# Altium schematic sheet DIOT_PSU_integrated.SchDoc: DI/OT Crate
size 420 x 297 mm; Project: DI/OT Backplane - Front panel PCB; CheckedBy: G. Daniluk; Author: F. Świtakowski; CompanyName: Creotech Instruments SA; DrawnBy: F. Świtakowski; Organization: CERN; Address1: European Organization for Nuclear Research; Address2: CH-1211 Geneve 23 - Switzerland; DocumentNumber: 1; Revision: -; SheetNumber: 1; SheetTotal: 1; EDA_Number: EDA-04213-V3-0; Projet: DI/OT Crate; CreateDate: 1.10.2019; CheckedDate: 10.11.2019; Title2: Front Interface; DivGrp: BE-CEM; Designer: F. Świtakowski; SPICEModelCacheTQWPXFHW: <root> / <DocumentId>TQWPXFHW</DocumentId> / </root>; DocumentName: AFPGA_power.SchDoc; ModifiedDate: -; Rule: PcbType=ProtelPcb
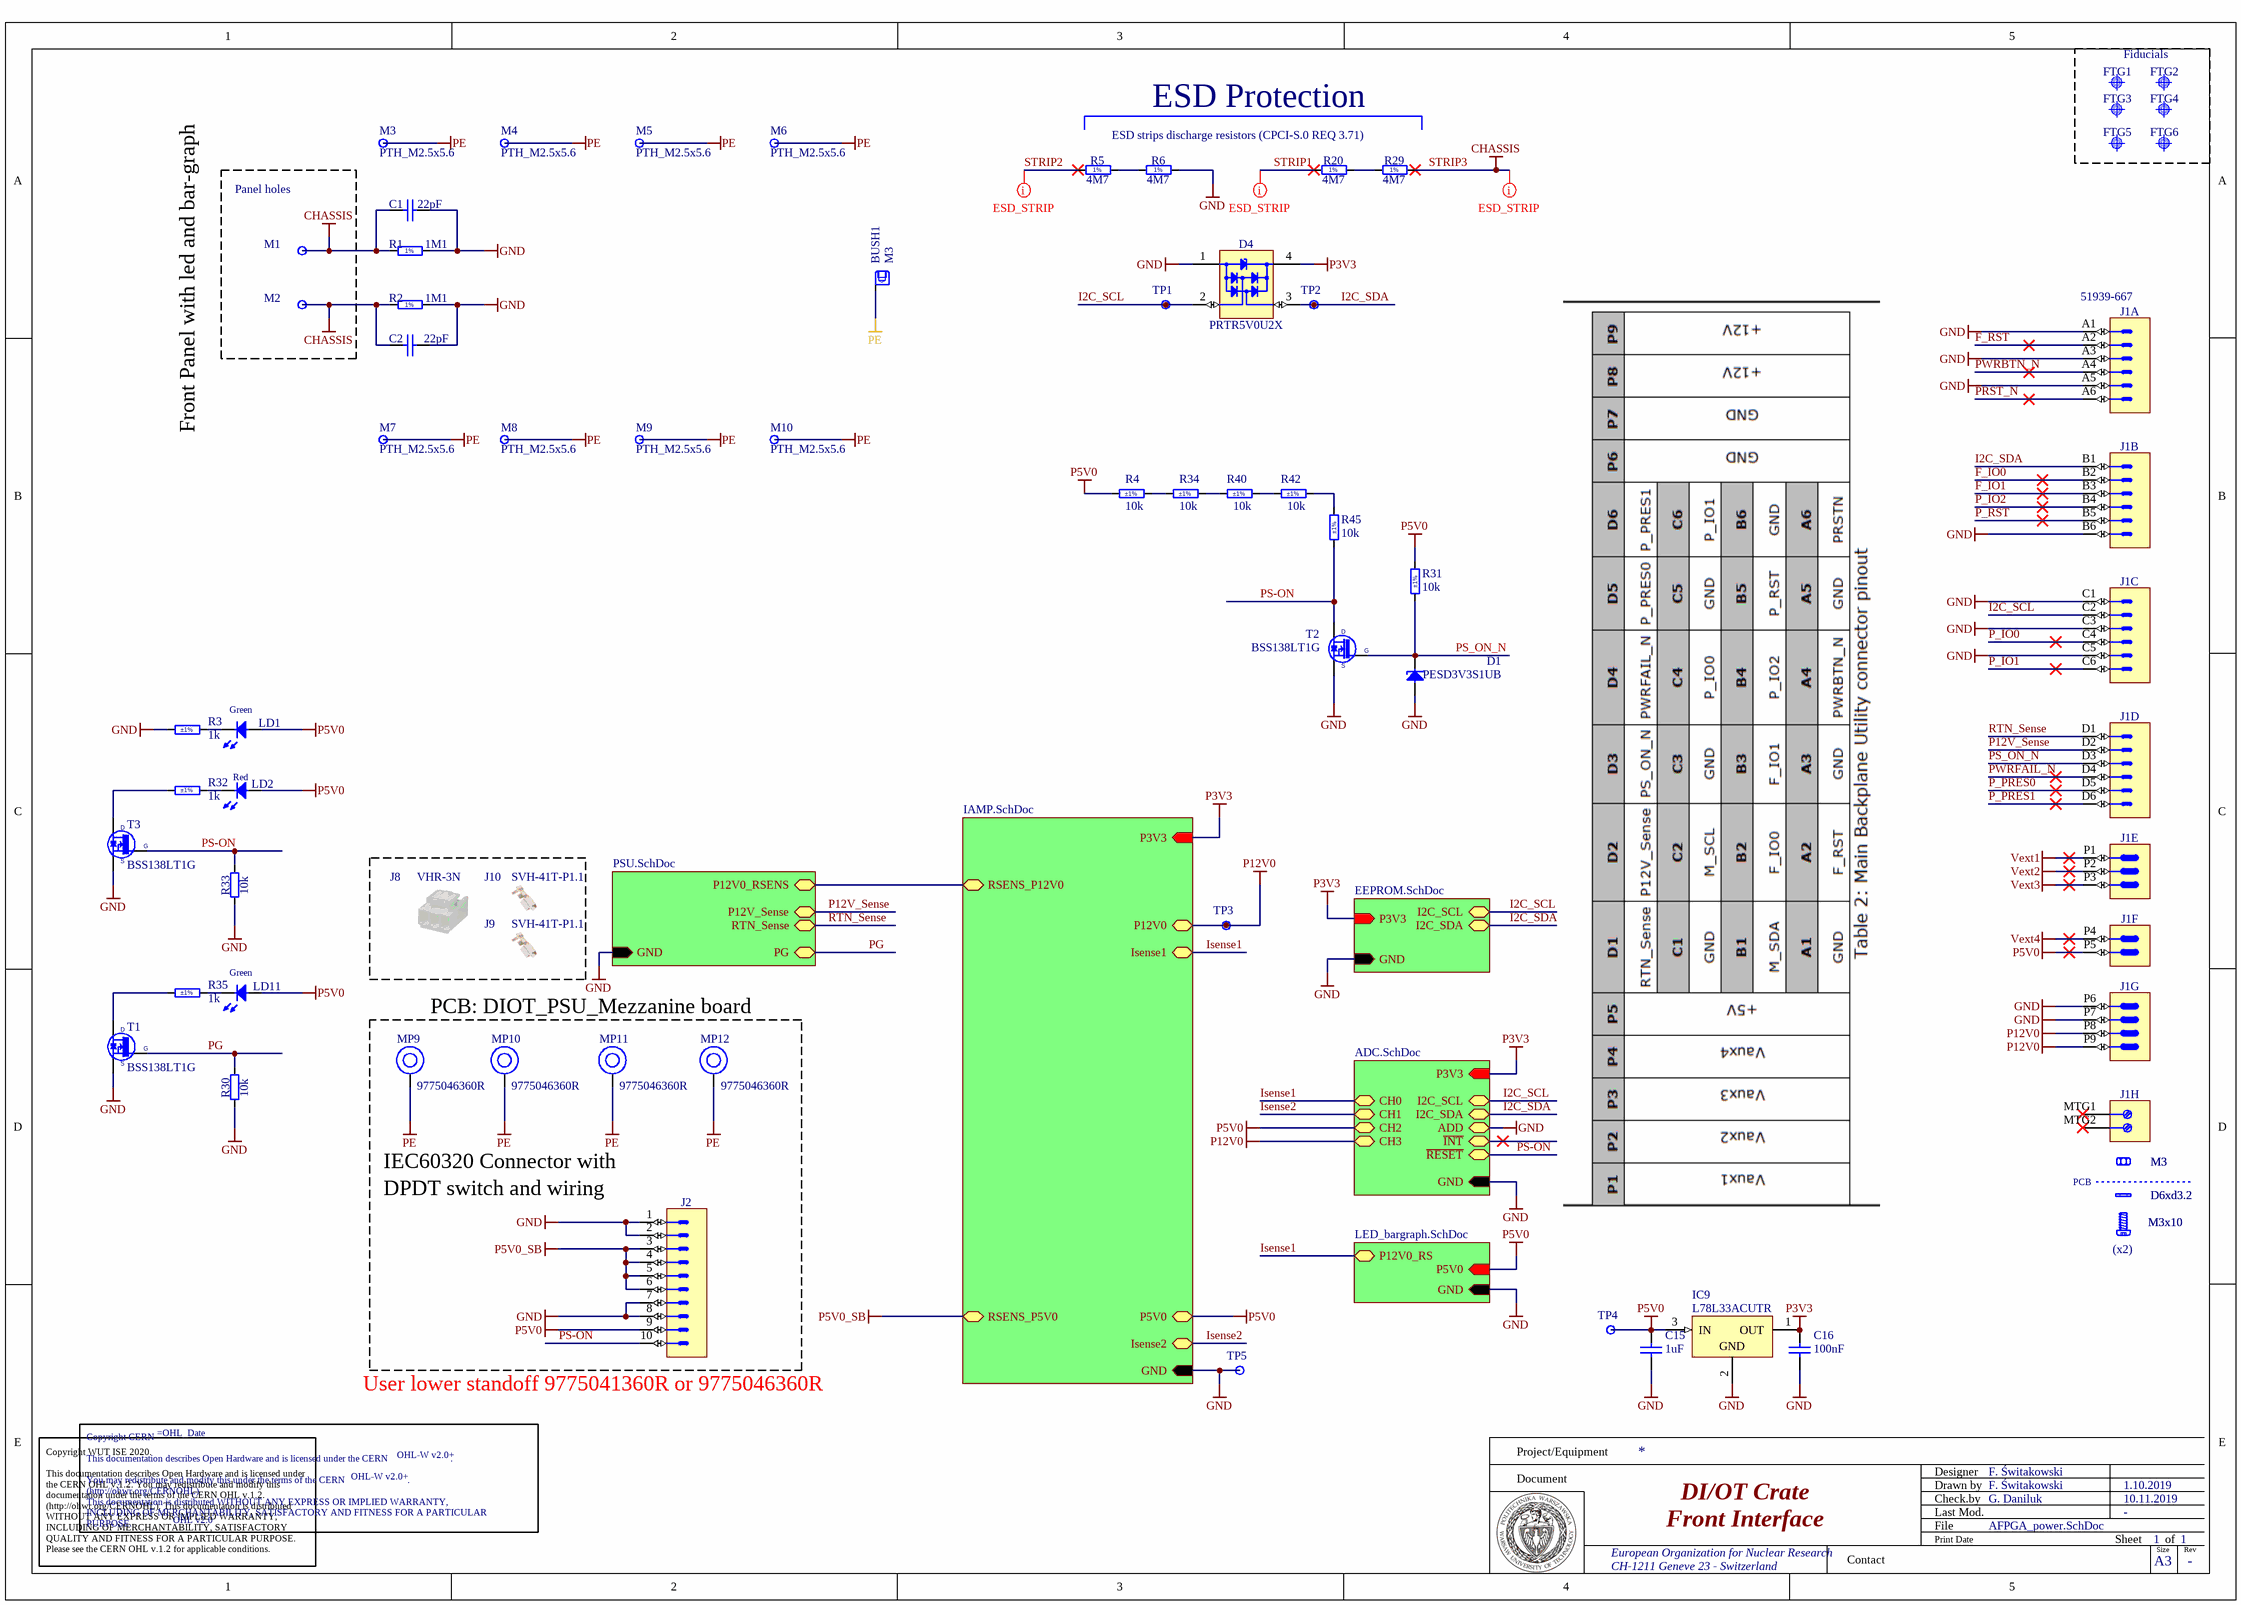
[diagram p0: DIOT_PSU_integrated.SchDoc]

## Parts
BUSH1  M3  [WURTH_7461057]
C1  22pF  [CAPC3216X180N]
C2  22pF  [CAPC3216X180N]
C15  1uF  [CAPC1608X87N]
C16  100nF  [CAPC1608X87N]
D1  PESD3V3S1UB  [SODFL1608X65N]
D4  PRTR5V0U2X  [SOT190P230X110-4N]
FTG1  (no value)  [FIDUCIAL_TOP_C100-200]
FTG2  (no value)  [FIDUCIAL_TOP_C100-200]
FTG3  (no value)  [FIDUCIAL_TOP_C100-200]
FTG4  (no value)  [FIDUCIAL_TOP_C100-200]
FTG5  Use only in PCB  [FIDUCIAL_TOP_S100-200]  (value not drawn)  (no BOM)
FTG6  Use only in PCB  [FIDUCIAL_TOP_S100-200]  (value not drawn)  (no BOM)
IC9  L78L33ACUTR  [SOT89]
J1  Manufacturer Part Number: 51939-667  [AMPHENOL_51939-667]  (hidden comment: PwrBlade)  (parts A,B,C,D,E,F,G,H of 8)
J2  Header 10  [SAMTEC_TSW-105-07-L-D-LL]  (value not drawn)
J8  VHR-3N  [VHR-3N]
J9  SVH-41T-P1.1  [SVH-41T-P1.1]
J10  SVH-41T-P1.1  [SVH-41T-P1.1]
LD1  Green  [LED_AVAGO_HSME-C120]
LD2  Red  [LED_AVAGO_HSMC-C120]
LD11  Green  [LED_AVAGO_HSME-C120]
M1  (no value)  [MTG300_600]  (no BOM)
M2  (no value)  [MTG300_600]  (no BOM)
M3  PTH_M2.5x5.6  [PTH_2,9x5.6]
M4  PTH_M2.5x5.6  [PTH_2,9x5.6]
M5  PTH_M2.5x5.6  [PTH_2,9x5.6]
M6  PTH_M2.5x5.6  [PTH_2,9x5.6]
M7  PTH_M2.5x5.6  [PTH_2,9x5.6]
M8  PTH_M2.5x5.6  [PTH_2,9x5.6]
M9  PTH_M2.5x5.6  [PTH_2,9x5.6]
M10  PTH_M2.5x5.6  [PTH_2,9x5.6]
MP9  9775046360R  [9775046360]
MP10  9775046360R  [9775046360]
MP11  9775046360R  [9775046360]
MP12  9775046360R  [9775046360]
NUT1  M3  [BOSSARD_BN628-1241443_v]
NUT2  M3  [BOSSARD_BN628-1241443_v]
OHL1  CERN_OHL  [CERN_OHL]  (value not drawn)  (no BOM)
R1  1M1  [RESC2012X60N]
R2  1M1  [RESC2012X60N]
R3  1k  Tolerance: ±1%  [RESC1608X55N]
R4  10k  Tolerance: ±1%  [RESC1608X55N]
R5  4M7  [RESC2113X55N]
R6  4M7  [RESC2113X55N]
R20  4M7  [RESC2113X55N]
R29  4M7  [RESC2113X55N]
R30  10k  [RESC1608X55N]
R31  10k  Tolerance: ±1%  [RESC1608X55N]
R32  1k  Tolerance: ±1%  [RESC1608X55N]
R33  10k  [RESC1608X55N]
R34  10k  Tolerance: ±1%  [RESC1608X55N]
R35  1k  Tolerance: ±1%  [RESC1608X55N]
R40  10k  Tolerance: ±1%  [RESC1608X55N]
R42  10k  Tolerance: ±1%  [RESC1608X55N]
R45  10k  Tolerance: ±1%  [RESC1608X55N]
SCREW1  M3x10  [BOSSARD_BN5687-3061608_v]
SCREW2  M3x10  [BOSSARD_BN5687-3061608_v]
T1  BSS138LT1G  [SOT95P240X110-3N]
T2  BSS138LT1G  [SOT95P240X110-3N]
T3  BSS138LT1G  [SOT95P240X110-3N]
TP1  Test Point  [TPS127]  (value not drawn)
TP2  Test Point  [TPS127]  (value not drawn)
TP3  Test Point  [TPS127]  (value not drawn)
TP4  Test Point  [TPS127]  (value not drawn)
TP5  Test Point  [TPS127]  (value not drawn)
WASHER1  D6xd3.2  [BOSSARD_BN83728-8243964_v]
WASHER2  D6xd3.2  [BOSSARD_BN83728-8243964_v]

## Blocks framed on the sheet
Fiducials: FTG1-FTG6
Panel holes: M1 M2

## Sub-sheets
Designator = EEPROM.SchDoc: I2C_SCL (bidir), I2C_SDA (bidir), P3V3 (in), GND (in)
Designator = ADC.SchDoc: CH0 (bidir), CH1 (bidir), CH2 (bidir), CH3 (bidir), I2C_SCL (bidir), I2C_SDA (bidir), ADD (bidir), ~{INT} (bidir), ~{RESET} (bidir), GND (in), P3V3 (in)
Designator = IAMP.SchDoc: RSENS_P5V0 (bidir), RSENS_P12V0 (bidir), Isense2 (bidir), Isense1 (bidir), P12V0 (bidir), P5V0 (bidir), P3V3 (in), GND (in)
Designator1 = LED_bargraph.SchDoc: P12V0_RS (bidir), GND (in), P5V0 (in)
Designator4 = PSU.SchDoc: P12V_Sense (bidir), RTN_Sense (bidir), PG (bidir), P12V0_RSENS (bidir), GND (in)

## Nets
GND: C1.2 C2.2 C15.1 C16.2 D1.2(A) D4.1(GND) IC9.2(GND) J1.A1 J1.A3 J1.A5 J1.B6 J1.C1 J1.C3 J1.C5 J1.P6 J1.P7 J2.1 J2.2 J2.7 J2.8 R1.2 R2.2 R3.1 R6.2 R30.1 R33.1 T1.2(S) T2.2(S) T3.2(S) TP5.1 ; sheet Designator1/GND, sheet Designator4/GND, sheet Designator/GND, sheet Designator/ADD, sheet Designator/GND, sheet Designator/GND
P3V3: C16.1 D4.4(VCC) IC9.1(OUT) ; sheet Designator/P3V3, sheet Designator/P3V3, sheet Designator/P3V3
P5V0: C15.2 IC9.3(IN) J1.P5 J2.9 LD1.2(A) LD2.2(A) LD11.2(A) R4.2 R31.2 TP4.1 ; sheet Designator1/P5V0, sheet Designator/CH2, sheet Designator/P5V0
P5V0_SB: J2.3 J2.4 J2.5 J2.6 ; sheet Designator/RSENS_P5V0
P12V0: J1.P8 J1.P9 TP3.1 ; sheet Designator/CH3, sheet Designator/P12V0
PE: BUSH1.1 M3.1 M4.1 M5.1 M6.1 M7.1 M8.1 M9.1 M10.1 MP9.1 MP10.1 MP11.1 MP12.1
STRIP3: C1.1 C2.1 M1.1 M2.1 R1.1 R2.1 R29.2  [also labelled CHASSIS]
Vext1: J1.P1
Vext2: J1.P2
Vext3: J1.P3
Vext4: J1.P4
F_IO0: J1.B2
F_IO1: J1.B3
F_RST: J1.A2
I2C_SCL: D4.2(I/O1) J1.C2 TP1.1 ; sheet Designator/I2C_SCL, sheet Designator/I2C_SCL
I2C_SDA: D4.3(I/O2) J1.B1 TP2.1 ; sheet Designator/I2C_SDA, sheet Designator/I2C_SDA
Isense1: sheet Designator1/P12V0_RS, sheet Designator/CH0, sheet Designator/Isense1
Isense2: sheet Designator/CH1, sheet Designator/Isense2
P12V_Sense: J1.D2 ; sheet Designator4/P12V_Sense
P_IO0: J1.C4
P_IO1: J1.C6
P_IO2: J1.B4
P_PRES0: J1.D5
P_PRES1: J1.D6
P_RST: J1.B5
PG: R30.2 T1.1(G) ; sheet Designator4/PG
PRST_N: J1.A6
PS-ON: J2.10 R33.2 R45.1 T2.3(D) T3.1(G) ; sheet Designator/~{RESET}
PS_ON_N: D1.1(C) J1.D3 R31.1 T2.1(G)
PWRBTN_N: J1.A4
PWRFAIL_N: J1.D4
RTN_Sense: J1.D1 ; sheet Designator4/RTN_Sense
STRIP1: R20.1
STRIP2: R5.1
NetLD1_1: LD1.1(C) R3.2
NetLD2_1: LD2.1(C) R32.2
NetLD11_1: LD11.1(C) R35.2
NetR4_1: R4.1 R34.1
NetR5_2: R5.2 R6.1
NetR20_2: R20.2 R29.1
NetR32_1: R32.1 T3.3(D)
NetR34_2: R34.2 R40.2
NetR35_1: R35.1 T1.3(D)
NetR40_1: R40.1 R42.1
NetR42_2: R42.2 R45.2
(unnamed): sheet Designator4/P12V0_RSENS, sheet Designator/RSENS_P12V0

Not connected (* = marked no-connect by the designer): J1 MTG1* MTG2*

## Layout directives
net class ESD_STRIP: STRIP1, STRIP2, STRIP3

## Notes on the sheet
- ESD strips discharge resistors (CPCI-S.0 REQ 3.71)
- ESD Protection
- Front Panel with led and bar-graph
- PCB: DIOT_PSU_Mezzanine board
- IEC60320 Connector with
- (near J2) DPDT switch and wiring
- PCB
- (x2)
- (near J2) User lower standoff 9775041360R or 9775046360R
- Project/Equipment
- Document
- Designer
- Drawn by
- Check.by
- Copyright WUT ISE 2020.
  This documentation describes Open Hardware and is licensed under the CERN OHL v.1.2. You may redistribute and modify this documentation under the terms of the CERN OHL v.1.2. (http://ohwr.org/CERNOHL). This documentation is distributed WITHOUT ANY EXPRESS OR IMPLIED WARRANTY, INCLUDING OF MERCHANTABILITY, SATISFACTORY QUALITY AND FITNESS FOR A PARTICULAR PURPOSE. Please see the CERN OHL v.1.2 for applicable conditions.
- Contact
- File
- Last Mod.
- Print Date
- Sheet
- Size
- A3
- of
- Rev
- (in symbol CERN_OHL) Copyright CERN / This documentation describes Open Hardware and is licensed under the CERN                         . / You may redistribute and modify this under the terms of the CERN                         . / (http://ohwr.org/CERNOHL) / This documentation is distributed WITHOUT ANY EXPRESS OR IMPLIED WARRANTY, / INCLUDING OF MERCHANTABILITY, SATISFACTORY AND FITNESS FOR A PARTICULAR PURPOSE. / Please see the CERN                   for applicable conditions.
- (in symbol R0805_1M1_1%_0.125W_100PPM) 1%
- (in symbol R0805_4M7_1%_0.125W_100PPM_VISHAY_CRCW e3) 1%

## Library data of the parts
BUSH1 = WURTH_7461057: Bush; Part Description: REDCUBE Bush with Threaded Hole M3 and Two Rows Press-Fit Pin-Plate, WP-BUTR Series; Manufacturer: WURTH; Part Number: WURTH_7461057; Component Kind: Standard; Component Type: Standard; Pin Count: 6; PackageDescription: 7x7x6mm REDCUBE Press-Fit with Internsl Threaded Hole M3,Two Rows Pin-Plate WP-BUTR; Mounted: Yes; Socket: No; SMD: No; PressFit: Yes; Sense: No; Status: None; Value: M3; Manufacturer Part Number: 7461057; ComponentHeight: 6mm; HelpURL: \\cern.ch\dfs\Applications\Altium\Datasheets\WURTH_7461057.pdf; Author: CERN DEM JLC; CreateDate: 13.08.2018; LatestRevisionDate: 13.08.2018
C1 C2 = CC1206_22PF_200V_1%_C0G_KEMET_C1206C220F2GAC: Non-polarised capacitor; Part Description: High Voltage, SMD Multilayer Chip Ceramic Capacitor; Manufacturer: KEMET; Voltage: 200V; TC: C0G/NP0; Tolerance: ±1%; Part Number: CC1206_22PF_200V_1%_C0G_KEMET_C1206C220F2GAC; Component Kind: Standard; Component Type: Standard; Pin Count: 2; Value: 22pF; Status: Not Recommended; Manufacturer Part Number: C1206C220F2GAC; Case: 1206; Mounted: Yes; Socket: No; SMD: Yes; Sense: No; ComponentHeight: 1.8mm; HelpURL: \\cern.ch\dfs\Applications\Altium\Datasheets\CC1206_KEMET_C1206C_C0G.pdf; Author: CERN DEM HF; CreateDate: 11.07.2022; LatestRevisionDate: 11.07.2022
C15 = CC0603_1UF_16V_10%_X7R: Non-polarised capacitor; Part Description: SMD Multilayer Chip Ceramic Capacitor; Manufacturer: GENERIC; Manufacturer1 Part Number: 223878615663; Voltage: 16V; TC: X7R; Tolerance: ±10%; Part Number: CC0603_1UF_16V_10%_X7R; Component Kind: Standard; Component Type: Standard; Pin Count: 2; Value: 1uF; Status: None; Manufacturer Part Number: CC0603_1UF_16V_10%_X7R; Case: 0603; Mounted: Yes; Socket: No; SMD: Yes; Manufacturer1 Example: YAGEO PHYCOMP; Manufacturer1 ComponentHeight: 0.9mm; HelpURL: \\cern.ch\dfs\Applications\Altium\Datasheets\CC0603_X7R_PHYCOMP.pdf; Author: CERN DEM JLC; CreateDate: 03.12.2007; LatestRevisionDate: 17.04.2015; Sense: No
C16 = CC0603_100NF_50V_10%_X5R: Non-polarised capacitor; Part Description: SMD Multilayer Chip Ceramic Capacitor; Manufacturer: GENERIC; Manufacturer1 Part Number: C1608X5R1H104K080; Voltage: 50V; TC: X5R; Tolerance: ±10%; Part Number: CC0603_100NF_50V_10%_X5R; Component Kind: Standard; Component Type: Standard; Pin Count: 2; Value: 100nF; Status: None; Manufacturer Part Number: CC0603_100NF_50V_10%_X5R; Case: 0603; Mounted: Yes; Socket: No; SMD: Yes; Sense: No; Manufacturer1 Example: TDK; Manufacturer1 ComponentHeight: 0.9mm; HelpURL: \\cern.ch\dfs\Applications\Altium\Datasheets\CC0603_X5R_TDK_C.pdf; Author: CERN DEM MR; CreateDate: 08.01.2016; LatestRevisionDate: 08.01.2016
D1 = PESD3V3S1UB: ESD protection diode; Part Description: ESD protection diode (23kV); Manufacturer: NXP SEMICONDUCTORS; Voltage: 3V3; Power: 330W; PressFit: No; Bonding: No; Part Number: PESD3V3S1UB; Component Kind: Standard; Component Type: Standard; Device: PESD3V3S1UB; PackageDescription: Ultra Small Outline Diode Flat Lead (SOD-523), Body; 1.2mm L X 0.8mm W X 0.65mm H, IPC Medium Density; Manufacturer Part Number: PESD3V3S1UB; Pin Count: 2; Case: SOD523; Mounted: Yes; Socket: No; SMD: Yes; Sense: No; ComponentHeight: 0.65mm; HelpURL: \\cern.ch\dfs\Applications\Altium\Datasheets\PESD3V3S1UB.pdf; Author: CERN DEM JLC; CreateDate: 29.11.2012; LatestRevisionDate: 29.11.2012
D4 = PRTR5V0U2X: Ultra Low Capacitance Double Rail-to-Rail ESD Protection Diode; Part Description: Ultra Low Capacitance (1pF) Double Rail-to-Rail ESD Protection Diode (8kV); Manufacturer: NXP SEMICONDUCTORS; Voltage: 5.5V; PressFit: No; Bonding: No; Part Number: PRTR5V0U2X; Component Kind: Standard; Component Type: Standard; Device: PRTR5V0U2X; PackageDescription: SOT143B, SOT, 1.90mm Pitch; 4 Pin, 1.30mm W X 2.90mm L X 1.10mm H body, IPC Medium Density; Manufacturer Part Number: PRTR5V0U2X; Pin Count: 4; Case: SOT143B; Mounted: Yes; Socket: No; SMD: Yes; Sense: No; ComponentHeight: 1.1mm; HelpURL: \\cern.ch\dfs\Applications\Altium\Datasheets\PRTR5V0U2X.pdf; Author: CERN DEM JLC; CreateDate: 22.03.2011; LatestRevisionDate: 22.03.2011
FTG1-FTG4 = FIDUCIAL_TARGET_C100-200: Fiducial Target; Part Description: Round Fiducial Target, Top Layer, 1.0mm, Top Solder 2.0mm, Keepout =2.0mm; Mounted: No; Table: Pads; Part Number: FIDUCIAL_TARGET_C100-200; Component Kind: Standard (No BOM); Component Type: Standard (No BOM); Pin Count: 1; Family: Fiducial; Socket: No; SMD: Yes; Status: None; ComponentHeight: 0mm; Author: CERN DEM JLC; CreateDate: 09/02/2010; LatestRevisionDate: 04/04/2012; PackageDescription: Round Fiducial Target, Top Layer, 1.0mm, Top Solder 2.0mm, Keepout =2.0mm; HelpURL: Undefined; Sense: No
FTG5 FTG6 = FIDUCIAL_TARGET_S100-200: Fiducial Target; Part Description: Square Fiducial Target, Top Layer, 1.0mm, Top Solder 2.0mm, Keepout =2.0mm; Mounted: No; Part Number: FIDUCIAL_TARGET_S100-200; Component Type: Standard (No BOM); Pin Count: 1; Family: Fiducial; Socket: No; SMD: Yes; Sense: No; Status: None; ComponentHeight: 0mm; HelpURL: Undefined; Author: CERN DEM JLC; CreateDate: 09.02.2010; LatestRevisionDate: 04.04.2012; PackageDescription: Square Fiducial Target, Top Layer, 1.0mm, Top Solder 2.0mm, Keepout =2.0mm
IC9 = L78L33ACUTR: 3-Terminal Regulator 1=OUT 2=GND 3=IN; Part Description: 33V 100mA Positive Voltage Regulator; Manufacturer: ST MICROELECTRONICS; PressFit: No; Bonding: No; Part Number: L78L33ACUTR; Component Kind: Standard; Component Type: Standard; Device: L78L33ACUTR; PackageDescription: SOT89-3, 3-Leads, Body 2.44x4.5mm; Manufacturer Part Number: L78L33ACUTR; Pin Count: 4; Case: SOT89; Mounted: Yes; Socket: No; SMD: Yes; Sense: No; ComponentHeight: 1.6mm; HelpURL: \\cern.ch\dfs\Applications\Altium\Datasheets\L78L33ACUTR.pdf; Author: CERN DEM JLC; CreateDate: 12.05.2014; LatestRevisionDate: 12.05.2014
J1 = AMPHENOL_51939-667: Thru-Hole, Lead 3.43mm, PowerBlade Right Angled Power Connector 3ACP 2P 24S 4P Contacts; Part Description: Right Angle PowerBlade Power Connector 3ACP + 2P + 24S + 4P Contacts; PressFit: No; Part Number: AMPHENOL_51939-667; Component Kind: Standard; Component Type: Standard; Pin Count: 33; Family: PwrBlade; Mounted: Yes; Socket: No; SMD: No; Sense: No; Status: None; Manufacturer: AMPHENOL; ComponentHeight: 12.57mm; HelpURL: \\cern.ch\dfs\Applications\Altium\Datasheets\AMPHENOL_51939-667.pdf; Author: CERN DEM JLC; CreateDate: 05.03.2019; LatestRevisionDate: 05.03.2019
J2 = SAMTEC_TSW-105-07-L-D-LL: Connector 10 Male; Part Description: 10 Contacts, Pitch 2.54mm, Dual Row Through Mount  Straight Header with Locking Lead (Lead Length 2.54mm); Manufacturer: SAMTEC; PressFit: No; Part Number: SAMTEC_TSW-105-07-L-D-LL; Component Kind: Standard; Component Type: Standard; Pin Count: 10; Family: Header 10; Mounted: Yes; Socket: No; SMD: No; Sense: No; Status: None; Manufacturer Part Number: TSW-105-07-L-D-LL; ComponentHeight: 8.38mm; HelpURL: \\cern.ch\dfs\Applications\Altium\Datasheets\SAMTEC_TSW-105-07-L-D-LL.pdf; Author: CERN DEM JLC; CreateDate: 23.01.2012; LatestRevisionDate: 26.07.2012
J8 = VHR-3N: 3 Rectangular Connectors - Housings Receptacle Natural 0.156" (3.96mm); Manufacturer: JST Sales America Inc.; PressFit: No; Part Number: VHR-3N; Component Kind: Standard; Component Type: Standard; Pin Count: 1; Family: VH; Mounted: Yes; Socket: No; SMD: No; Sense: No; Status: None; Part Description: 3 Rectangular Connectors - Housings Receptacle Natural 0.156" (3.96mm); Manufacturer Part Number: VHR-3N; HelpURL: https://www.jst-mfg.com/product/pdf/eng/eVH.pdf; Author: LPA; CreateDate: 09.02.2025; LatestRevisionDate: 09.02.2025
J9 J10 = SVH-41T-P1.1: Socket Contact Tin 16-20 AWG Crimp; Manufacturer: JST Sales America Inc.; PressFit: No; Part Number: SVH-41T-P1.1; Component Kind: Socket Contact; Component Type: Socket Contact; Pin Count: 1; Family: vh; Mounted: Yes; Socket: No; SMD: No; Sense: No; Status: None; Part Description: Socket Contact Tin 16-20 AWG Crimp; Manufacturer Part Number: SVH-41T-P1.1; ComponentHeight: N/A; HelpURL: https://www.jst-mfg.com/product/pdf/eng/eVH.pdf; Author: LPA; CreateDate: 09.02.2025; LatestRevisionDate: 09.02.2025
LD1 LD11 = LED_AVAGO_HSME-C120: LED Green 1C 2A; Part Description: High Performance Right Angle Chip Green LED; Manufacturer: AVAGO TECHNOLOGIES; PressFit: No; Bonding: No; Part Number: LED_AVAGO_HSME-C120; Component Kind: Standard; Component Type: Standard; Color: Green; PackageDescription: Green Chip LED, 2-Leads, Body 1.7x1.1mm, Side Emitting Package; Manufacturer Part Number: HSME-C120; Pin Count: 2; Mounted: Yes; Socket: No; SMD: Yes; Sense: No; ComponentHeight: 0.7mm; HelpURL: \\cern.ch\dfs\Applications\Altium\Datasheets\LED_AVAGO_HSME-C120.pdf; ComponentLink1URL: \\cern.ch\dfs\Applications\Altium\Datasheets\LED_AVAGO_HSME-C110_DESIGN-GUIDE.pdf; ComponentLink1Description: Design Guide; Author: CERN DEM JMW; CreateDate: 22.07.2009; LatestRevisionDate: 20.06.2012
LD2 = LED_AVAGO_HSMC-C120: LED Red 1C 2A; Part Description: High Performance Right Angle Chip Red LED; Manufacturer: AVAGO TECHNOLOGIES; PressFit: No; Bonding: No; Part Number: LED_AVAGO_HSMC-C120; Component Kind: Standard; Component Type: Standard; Color: Red; PackageDescription: Red Chip LED, 2-Leads, Body 1.7x1.1mm, Side Emitting Package; Manufacturer Part Number: HSMC-C120; Pin Count: 2; Mounted: Yes; Socket: No; SMD: Yes; Sense: No; ComponentHeight: 0.7mm; HelpURL: \\cern.ch\dfs\Applications\Altium\Datasheets\LED_AVAGO_HSMC-C120.pdf; ComponentLink1URL: \\cern.ch\dfs\Applications\Altium\Datasheets\LED_AVAGO_HSMC-C120_DESIGN-GUIDE.pdf; ComponentLink1Description: Design Guide; Author: CERN DEM JMW; CreateDate: 22.07.2009; LatestRevisionDate: 20.06.2012
M1 M2 = PLATED_HOLE3.0_PAD6.0: Single Terminal Socket; Part Description: Plated Through Hole: Hole Dia.=3.0mm Pad Dia.=6.0mm; Mounted: No; Table: Pads; Part Number: PLATED_HOLE3.0_PAD6.0; Component Type: Standard (No BOM); Designator: Single Terminal Socket; Library Reference: Single Terminal Socket; Pin Count: 1; Family: Plated Hole; Socket: No; SMD: No; Status: None; ComponentHeight: 0mm; Author: CERN DEM JLC; CreateDate: 26/05/2008; LatestRevisionDate: 26/05/2008; PackageDescription: Plated Through Hole: Hole Dia.=3.0mm Pad Dia.=6.0mm; HelpURL: Undefined; Sense: No
M3-M10 = CMP-00028-00016-1: Plated Hole for scre 2.5mm
MP9-MP12 = CMP-00028-00014-3: WA-SMSR SMT Steel Spacer, Reverse M3 non Stop
NUT1 NUT2 = BOSSARD_BN628-1241443_v: Nut; Part Description: M3 Hexagon Nut ~0,8d, ISO 4032, DIN 934, Stainless Steel A2; Manufacturer Part Number: BN628 Art.1241443; PressFit: No; Part Number: BOSSARD_BN628-1241443_v; Component Kind: Standard; Component Type: Mechanical; Pin Count: 0; PackageDescription: M3 Hexagon Nut ~0,8d, ISO 4032, DIN 934, Stainless Steel A2; Mounted: Yes; Socket: No; SMD: No; Sense: No; Status: None; Value: M3; Manufacturer: BOSSARD; ComponentHeight: 2.4mm; HelpURL: \\cern.ch\dfs\Applications\Altium\Datasheets\BOSSARD_BN628-1241443.pdf; Author: CERN DEM JMW; CreateDate: 04.12.2015; LatestRevisionDate: 04.12.2015
OHL1 = CERN_OHL: Part Description: Copyright CERN; OHL_License: OHL-W v2.0+; OHL_Version: OHL v2.0; Mounted: No; OHL_Date: =Year; Part Number: CERN_OHL; Component Type: Standard (No BOM); Pin Count: 0; Socket: No; SMD: No; Sense: No; Status: None; ComponentHeight: 0mm; HelpURL: Undefined; Author: CERN DEM HF; CreateDate: 03.12.2021; LatestRevisionDate: 03.12.2021; PackageDescription: Texte Copyright Cern
R1 R2 = R0805_1M1_1%_0.125W_100PPM: Resistor - 1%; Part Description: General Purpose Thick Film Chip Resistor; Manufacturer: GENERIC; Manufacturer1 Part Number: NRC10F1104TRF; Power: 0.125W; TC: ±100ppm/°C; PressFit: No; Part Number: R0805_1M1_1%_0.125W_100PPM; Component Kind: Standard; Component Type: Standard; Pin Count: 2; Value: 1M1; Status: Preferred; Tolerance: ±1%; Manufacturer Part Number: R0805_1M1_1%_0.125W_100PPM; Case: 0805; Mounted: Yes; Sense: No; Socket: No; SMD: Yes; Manufacturer1 Example: NIC COMPONENT; Manufacturer1 ComponentHeight: 0.6mm; HelpURL: \\cern.ch\dfs\Applications\Altium\Datasheets\R0805_NIC_NRC.pdf; Author: CERN DEM JLC; CreateDate: 03/12/2007; LatestRevisionDate: 13/03/2008
R3 R32 R35 = R0603_1K_1%_0.1W_100PPM: Resistor - 1%; Part Description: General Purpose Thick Film Chip Resistor; Manufacturer: GENERIC; Manufacturer1 Part Number: NRC06F1001TRF; Power: 0.1W; TC: ±100ppm/°C; PressFit: No; Part Number: R0603_1K_1%_0.1W_100PPM; Component Kind: Standard; Component Type: Standard; Pin Count: 2; Value: 1k; Status: Preferred; Manufacturer Part Number: R0603_1K_1%_0.1W_100PPM; Case: 0603; Mounted: Yes; Sense: No; Socket: No; SMD: Yes; Manufacturer1 Example: NIC COMPONENT; Manufacturer1 ComponentHeight: 0.55mm; HelpURL: \\cern.ch\dfs\Applications\Altium\Datasheets\R0603_NIC_NRC.pdf; Author: CERN DEM JLC; CreateDate: 03.12.2007; LatestRevisionDate: 13.03.2008
R4 R30 R31 R33 R34 R40 R42 R45 = R0603_10K_1%_0.1W_100PPM: Resistor - 1%; Part Description: General Purpose Thick Film Chip Resistor; Manufacturer: GENERIC; Manufacturer1 Part Number: NRC06F1002TRF; Power: 0.1W; TC: ±100ppm/°C; PressFit: No; Part Number: R0603_10K_1%_0.1W_100PPM; Component Kind: Standard; Component Type: Standard; Pin Count: 2; Value: 10k; Status: Preferred; Manufacturer Part Number: R0603_10K_1%_0.1W_100PPM; Case: 0603; Mounted: Yes; Sense: No; Socket: No; SMD: Yes; Manufacturer1 Example: NIC COMPONENT; Manufacturer1 ComponentHeight: 0.55mm; HelpURL: \\cern.ch\dfs\Applications\Altium\Datasheets\R0603_NIC_NRC.pdf; Author: CERN DEM JLC; CreateDate: 03.12.2007; LatestRevisionDate: 13.03.2008
  R30 R33: Tolerance: ±1%
R5 R6 R20 R29 = R0805_4M7_1%_0.125W_100PPM_VISHAY_CRCW e3: Resistor - 1%; Part Description: 150V, Standard Thick Film Chip Resistor; Manufacturer: VISHAY; Manufacturer Part Number: CRCW08054M70FKEA; Power: 0.125W; TC: ±100ppm/°C; PressFit: No; Part Number: R0805_4M7_1%_0.125W_100PPM_VISHAY_CRCW e3; Component Kind: Standard; Component Type: Standard; Pin Count: 2; Value: 4M7; Status: None; Tolerance: ±1%; Case: 0805; Mounted: Yes; Sense: No; Socket: No; SMD: Yes; ComponentHeight: 0.5mm; HelpURL: \\cern.ch\dfs\Applications\Altium\Datasheets\R0805_VISHAY_CRCW e3.pdf; Author: CERN DEM BR; CreateDate: 27/05/2019; LatestRevisionDate: 27/05/2019
SCREW1 SCREW2 = BOSSARD_BN5687-3061608_v: Screw; Part Description: M3 L=10mm Hexalobular Socket Pan Head Screw, Fully Threaded, Stainless Steel A2; Manufacturer Part Number: BN5687 Art.3061608; PressFit: No; Part Number: BOSSARD_BN5687-3061608_v; Component Kind: Standard; Component Type: Mechanical; Pin Count: 0; PackageDescription: M3 L=10mm Hexalobular Socket Pan Head Screw, Fully Threaded - Stainless Steel A2; Mounted: Yes; Socket: No; SMD: No; Sense: No; Status: None; Value: M3x10; Manufacturer: BOSSARD; ComponentHeight: 12.4mm; HelpURL: \\cern.ch\dfs\Applications\Altium\Datasheets\BOSSARD_BN5687-3061608.pdf; Author: CERN DEM JLC; CreateDate: 22.08.2013; LatestRevisionDate: 22.08.2013
T1 T3 = BSS138LT1G: N-CHANNEL MOSFET WITH DIODE; Part Description: 50V 200mA N-Channel Enhancement Mode Field-Effect Transistor; Manufacturer: ON SEMICONDUCTOR; PressFit: No; Bonding: No; Part Number: BSS138LT1G; Component Kind: Standard; Component Type: Standard; Device: BSS138LT1G; PackageDescription: SOT23 3-Leads, Pitch 0.95mm - Body 1.4x3mm, IPC Medium Density; Manufacturer Part Number: BSS138LT1G; Pin Count: 3; Case: SOT23-3; Mounted: Yes; Socket: No; SMD: Yes; Sense: No; ComponentHeight: 1.11mm; HelpURL: \\cern.ch\dfs\Applications\Altium\Datasheets\BSS138LT1G.pdf; Author: CERN DEM JLC; CreateDate: 23.03.2009; LatestRevisionDate: 23.03.2009
T2 = BSS138LT1G: N-CHANNEL MOSFET WITH DIODE; Part Description: 50V, 200mA N-Channel Enhancement Mode Field-Effect Transistor; Manufacturer: ON SEMICONDUCTOR; PressFit: No; Bonding: No; Part Number: BSS138LT1G; Component Kind: Standard; Component Type: Standard; Device: BSS138LT1G; PackageDescription: SOT23, 0.95mm Pitch; 3 Pin, 1.40mm W X 3.00mm L X 1.10mm H body, IPC Medium Density; Manufacturer Part Number: BSS138L; Pin Count: 3; Case: SOT23-3; Mounted: Yes; Socket: No; SMD: Yes; Sense: No; ComponentHeight: 1.11mm; HelpURL: \\cern.ch\dfs\Applications\Altium\Datasheets\BSS138LT1G.pdf; Author: CERN DEM JLC; CreateDate: 23.03.2009; LatestRevisionDate: 25.05.2022
TP1-TP5 = SMD_PAD_1.27X1.27MM: Part Description: 1.27mm x 1.27mm PCB Copper Area (SMD Test Point); Mounted: No; Part Number: SMD_PAD_1.27X1.27MM; Component Kind: Standard (No BOM); Component Type: Standard (No BOM); Pin Count: 1; Family: Test Point; Socket: No; SMD: Yes; Sense: No; Status: None; ComponentHeight: 0mm; HelpURL: Undefined; Author: CERN DEM JLC; CreateDate: 12.01.2008; LatestRevisionDate: 12.01.2008; PackageDescription: 1.27mm x 1.27mm PCB Copper Area (SMD Test Point)
WASHER1 WASHER2 = BOSSARD_BN83728-8243964_v: Washer; Part Description: Waved Spring Washer for M3 Screw - Steel 440-520 HV - Zinc Plated Blue; Manufacturer Part Number: BN83728 Art.8243964; PressFit: No; Part Number: BOSSARD_BN83728-8243964_v; Component Kind: Standard; Component Type: Mechanical; Pin Count: 0; PackageDescription: Waved Spring Washer for M3 Screw, Steel 440-520 HV, Zinc Plated Blue; Mounted: Yes; Socket: No; SMD: No; Sense: No; Status: None; Value: D6xd3.2; Manufacturer: BOSSARD; ComponentHeight: 0.4mm; HelpURL: \\cern.ch\dfs\Applications\Altium\Datasheets\BOSSARD_BN83728-8243964.pdf; Author: CERN DEM JLC; CreateDate: 27.04.2017; LatestRevisionDate: 27.04.2017